# Altium schematic sheet Nucleo-F303RE extension board.SchDoc
size A4; SheetNumber: 1; SheetTotal: 1
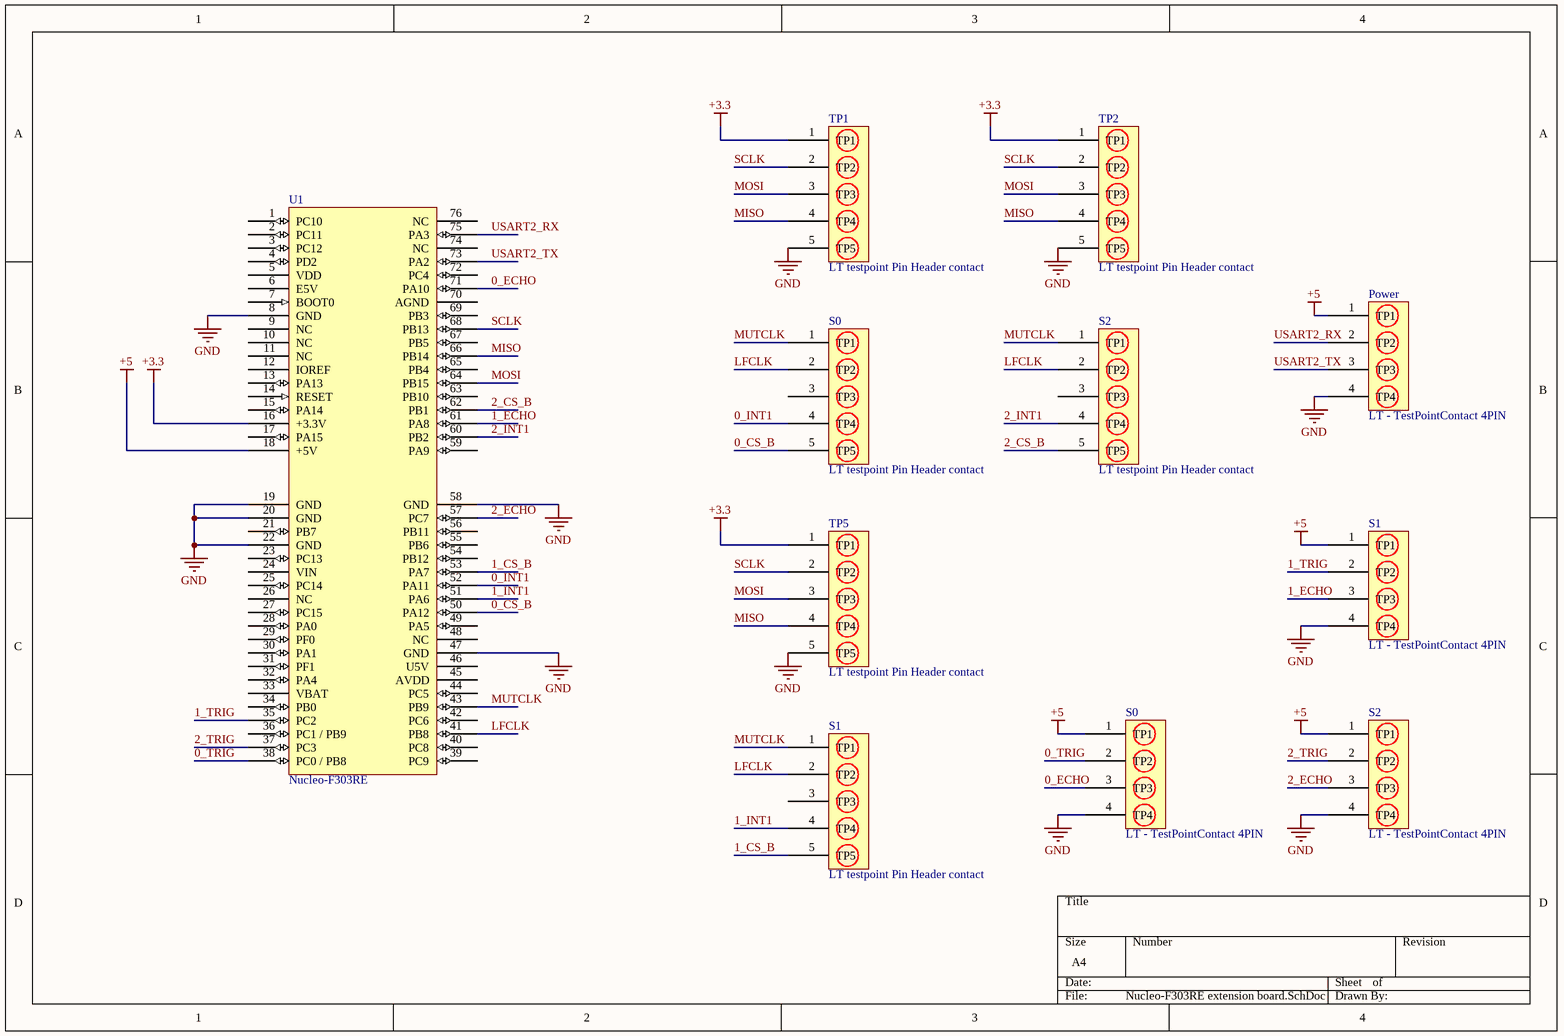
[diagram p0: Nucleo-F303RE extension board.SchDoc]

## Parts
(Parts that share a designator on the sheet are numbered #1, #2 ... from top to bottom, then left to right.)
Power  LT - TestPointContact 4PIN  [New footprint 1]
S0#1  LT testpoint Pin Header contact  [New footprint 1]
S0#2  LT - TestPointContact 4PIN  [New footprint 1]
S1#1  LT - TestPointContact 4PIN  [New footprint 1]
S1#2  LT testpoint Pin Header contact  [New footprint 1]
S2#1  LT testpoint Pin Header contact  [New footprint 1]
S2#2  LT - TestPointContact 4PIN  [New footprint 1]
TP1  LT testpoint Pin Header contact  [New footprint 1]
TP2  LT testpoint Pin Header contact  [New footprint 1]
TP5  LT testpoint Pin Header contact  [New footprint 1]
U1  Nucleo-F303RE  [New footprint 1]

## Nets
+3.3: TP1.1(TP1) TP2.1(TP1) TP5.1(TP1) U1.16(+3.3V)
+5: Power.1(TP1) S0#2.1(TP1) S1#1.1(TP1) S2#2.1(TP1) U1.18(+5V)
GND: Power.4(TP4) S0#2.4(TP4) S1#1.4(TP4) S2#2.4(TP4) TP1.5(TP5) TP2.5(TP5) TP5.5(TP5) U1.8(GND) U1.19(GND) U1.20(GND) U1.22(GND) U1.47(GND) U1.58(GND)
0_CS_B: S0#1.5(TP5) U1.50(PA12)
0_ECHO: S0#2.3(TP3) U1.71(PA10)
0_INT1: S0#1.4(TP4) U1.52(PA11)
0_TRIG: S0#2.2(TP2) U1.38(PC0_/_PB8)
1_CS_B: S1#2.5(TP5) U1.53(PA7)
1_ECHO: S1#1.3(TP3) U1.61(PA8)
1_INT1: S1#2.4(TP4) U1.51(PA6)
1_TRIG: S1#1.2(TP2) U1.35(PC2)
2_CS_B: S2#1.5(TP5) U1.62(PB1)
2_ECHO: S2#2.3(TP3) U1.57(PC7)
2_INT1: S2#1.4(TP4) U1.60(PB2)
2_TRIG: S2#2.2(TP2) U1.37(PC3)
LFCLK: S0#1.2(TP2) S1#2.2(TP2) S2#1.2(TP2) U1.41(PB8)
MISO: TP1.4(TP4) TP2.4(TP4) TP5.4(TP4) U1.66(PB14)
MOSI: TP1.3(TP3) TP2.3(TP3) TP5.3(TP3) U1.64(PB15)
MUTCLK: S0#1.1(TP1) S1#2.1(TP1) S2#1.1(TP1) U1.43(PB9)
SCLK: TP1.2(TP2) TP2.2(TP2) TP5.2(TP2) U1.68(PB13)
USART2_RX: Power.2(TP2) U1.75(PA3)
USART2_TX: Power.3(TP3) U1.73(PA2)

Not connected (* = marked no-connect by the designer): S0#1 3(TP3); S1#2 3(TP3); S2#1 3(TP3); U1 1(PC10) 2(PC11) 3(PC12) 4(PD2) 5(VDD) 6(E5V) 7(BOOT0) 9(NC) 10(NC) 11(NC) 12(IOREF) 13(PA13) 14(RESET) 15(PA14) 17(PA15) 21(PB7) 23(PC13) 24(VIN) 25(PC14) 26(NC) 27(PC15) 28(PA0) 29(PF0) 30(PA1) 31(PF1) 32(PA4) 33(VBAT) 34(PB0) 36(PC1_/_PB9) 39(PC9) 40(PC8) 42(PC6) 44(PC5) 45(AVDD) 46(U5V) 48(NC) 49(PA5) 54(PB12) 55(PB6) 56(PB11) 59(PA9) 63(PB10) 65(PB4) 67(PB5) 69(PB3) 70(AGND) 72(PC4) 74(NC) 76(NC)

## Library data of the parts
Power S0#2 S1#1 S2#2 = CMP-002-00081-2: 4Pin Testpoint contact
S0#1 S1#2 S2#1 TP1 TP2 TP5 = CMP-002-00080-3: 5 pin testpoint contact; Gender: F; Pins: 5
U1 = CMP-00030-00005-1: LT - Nucleo-F303RE